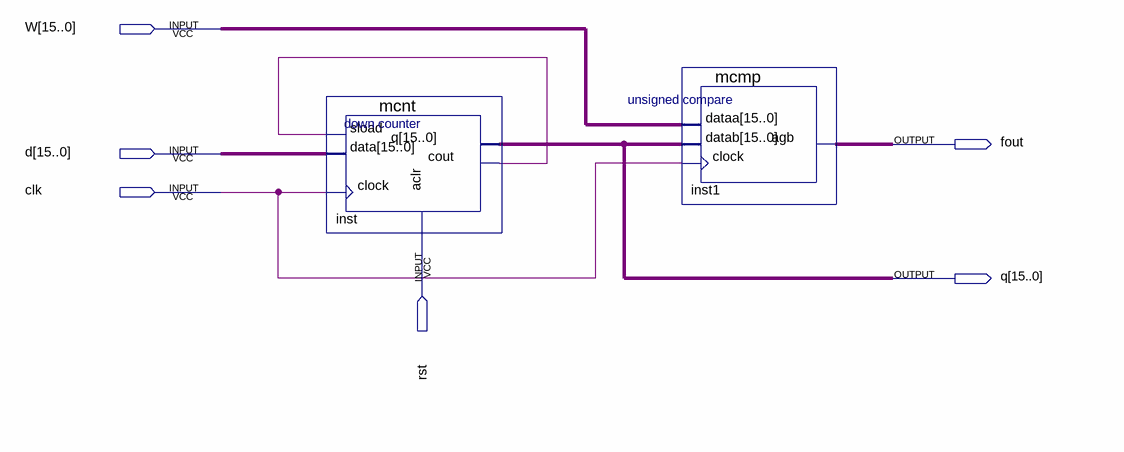
[diagram p0: schematic sheet]
// Quartus schematic fdiv.bdf as structural Verilog: 2 symbols, 6 pins
module fdiv (
  input  [15:0] W,
  input  [15:0] d,
  input  clk,
  input  rst,
  output fout,
  output [15:0] q
);

  wire inst_cout;

  mcnt inst (.sload(inst_cout), .data(d), .clock(clk), .aclr(rst), .cout(inst_cout), .q(q));
  mcmp inst1 (.dataa(W), .datab(q), .clock(clk), .agb(fout));
endmodule
